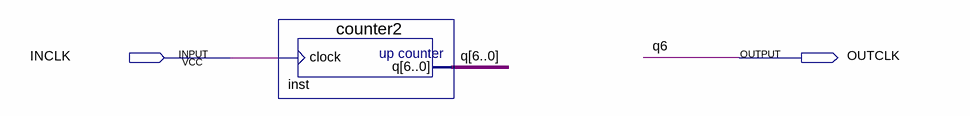
[diagram p0: schematic sheet]
// Quartus schematic mycounter2.bdf as structural Verilog: 1 symbols, 2 pins
module mycounter2 (
  input  INCLK,
  output OUTCLK
);

  wire [5:0] q;

  counter2 inst (.clock(INCLK), .q({OUTCLK, q}));

  // Other names for the same wires on the sheet: q[6] = OUTCLK; q6 = OUTCLK
endmodule
